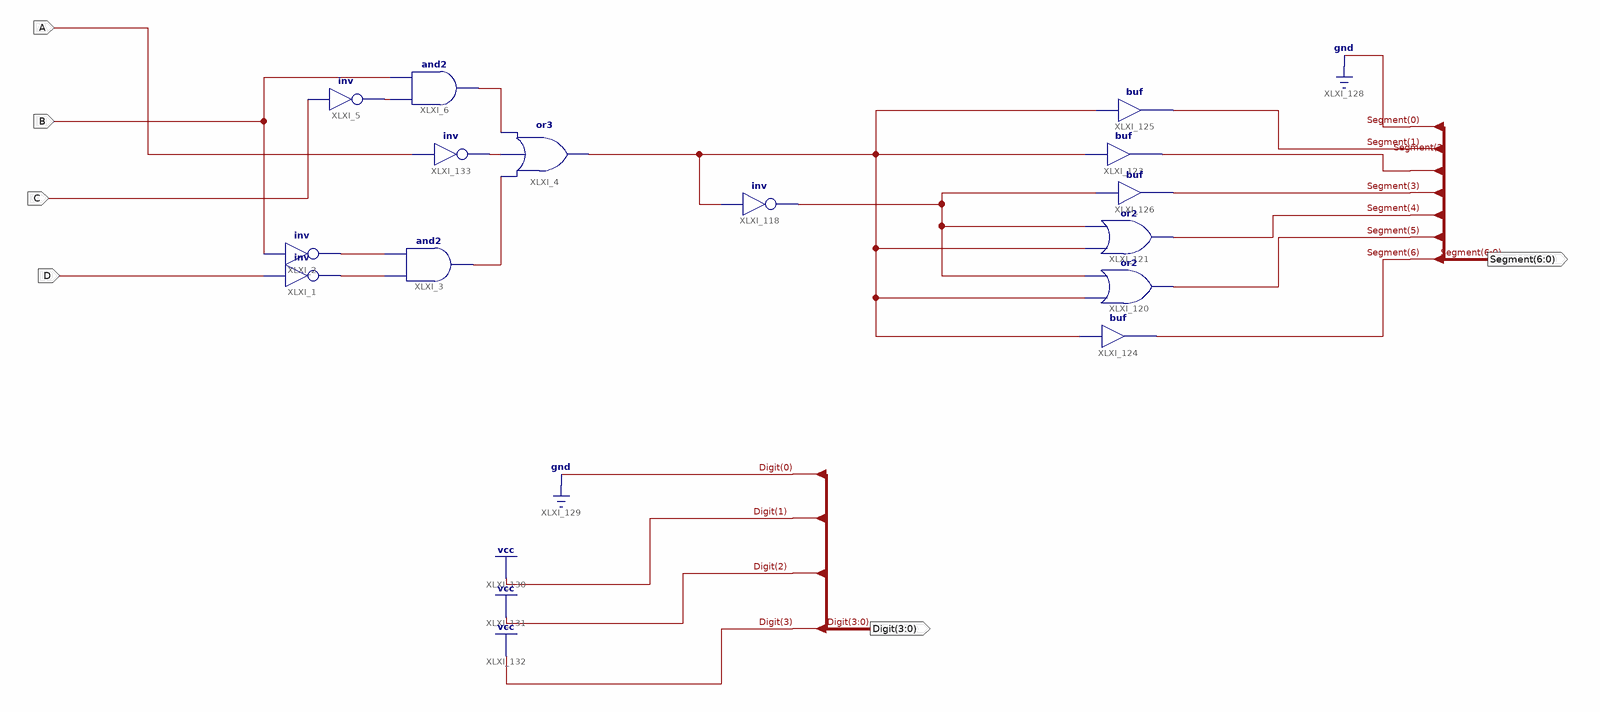
[diagram p0: schematic sheet 1]
// Xilinx ISE schematic moduleLab03.sch (spartan6) as structural Verilog: 14 symbols, 6 ports
module moduleLab03 (
  input  A,
  input  B,
  input  C,
  input  D,
  output [6:0] Segment,
  output [3:0] Digit
);

  wire MN7_0, XLXN_7, XLXN_8, XLXN_9, XLXN_11, XLXN_18, XLXN_330, XLXN_399;

  not XLXI_1 (XLXN_7, D);
  not XLXI_2 (XLXN_8, B);
  and XLXI_3 (XLXN_9, XLXN_7, XLXN_8);
  or XLXI_4 (MN7_0, XLXN_9, XLXN_399, XLXN_18);
  not XLXI_5 (XLXN_11, C);
  and XLXI_6 (XLXN_18, XLXN_11, B);
  not XLXI_118 (XLXN_330, MN7_0);
  or XLXI_120 (Segment[5], MN7_0, XLXN_330);
  or XLXI_121 (Segment[4], MN7_0, XLXN_330);
  buf XLXI_124 (Segment[6], MN7_0);
  buf XLXI_123 (Segment[2], MN7_0);
  buf XLXI_125 (Segment[1], MN7_0);
  buf XLXI_126 (Segment[3], XLXN_330);
  not XLXI_133 (XLXN_399, A);

  assign Digit = 4'b1110;
  assign Segment[0] = 1'b0;
endmodule
